# Altium schematic sheet 02_5V_Regulator_Circuit.SchDoc
size A; SheetNumber: 3; SheetTotal: 8
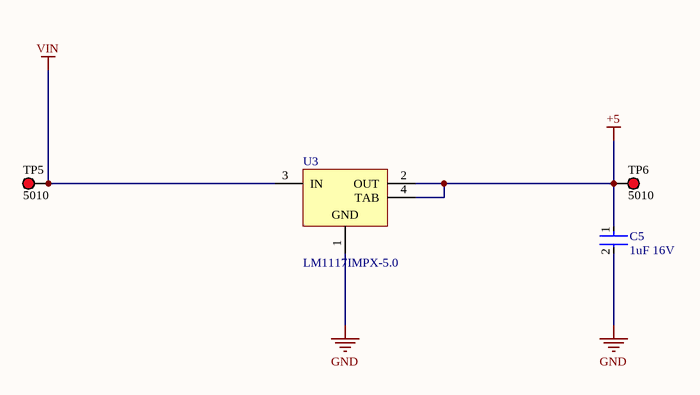
[diagram p0: 02_5V_Regulator_Circuit.SchDoc]

## Parts
C5  1uF 16V  [FP-CL10B105KO8NNNC-MFG]
TP5  5010  [KSTN-5010_V]
TP6  5010  [KSTN-5010_V]
U3  LM1117IMPX-5.0  [DCY0004A_M]

## Nets
+5: C5.1 TP6.1 U3.2(OUT) U3.4(TAB)
GND: C5.2 U3.1(GND)
VIN: TP5.1 U3.3(IN)

## Library data of the parts
C5 = CMP-2000-06093-2: CAP CER 1UF 16V X7R 0603; Manufacturer: Samsung Electro-Mechanics America, Inc; Manufacturer Part Number: CL10B105KO8NNNC; Temperature Coefficient: 15%; Material: Ceramic; Tolerance: 10%; Voltage Rating: 16V; Automotive: No; ComponentLink2Description: Datasheet; Device Class L3: Ceramic Capacitors; Capacitance: 1uF; Temperature Characteristic: X7R; Temperature Range High: +125°C; Digikey Description: CAP CER 1UF 16V X7R 0603; Device Class L2: Capacitors; Octopart: https://octopart.com/cl10b105ko8nnnc-samsung-19018973; ComponentLink2URL: http://www.samsungsem.com/global/front/downloadcms.do?path=%2F%2Fglobal%2F%2Fsupport%2F%2Fproduct-search%2F%2Fmlcc%2F%2F__icsFiles%2F%2Fafieldfile%2F%2F2019%2F%2F06%2F%2F18&fileName=CL10B105KO8NNNC-19.pdf; Lead Free: Yes; Height: 0.9mm; Package: CL10B105KO8NNNC; Temperature Range Low: -55°C; Value: 1uF; Device Class L1: Passive Components; RoHS: TRUE; Temperature: -55°C to +125°C; Category: Cap; Ipc Land Pattern Name: CAPC16080X80
TP5 TP6 = CMP-1672-00002-4: Test Point, Red, Through Hole, RoHS, Bulk; Manufacturer: Keystone; Contact Material: Bronze; Mounting Technology: Through Hole; RoHSCompliant: true; Pins: 1; Package Quantity: 100; ComponentLink2Description: Datasheet; Height: 8.12 mm; ComponentLink1URL: http://www.keyelco.com/; DatasheetVersion: Rev. F, 12/2013; Mount: Through Hole; PackageReference: 5010; Contact Plating: Silver; Packaging: Bulk; Colour: Red; REACH SVHC: No SVHC; PackageDescription: 1-Pin Through Hole Device, Dia 3.17 mm; ComponentLink2URL: http://www.keyelco.com/product-pdf.cfm?p=1319; ComponentLink1Description: Manufacturer URL
U3 = CMP-0062-01626-4: 800mA Low-Dropout Linear Regulator, 4-pin SOT-223; Manufacturer: Texas Instruments; PowerWise: N; CompType: LDO IC; High-Reliability: Y; PackageTopMarking: XYTT*N06B; ComponentLink1URL: http://www.ti.com/general/docs/lit/getliterature.tsp?genericPartNumber=LM1117-N&fileType=pdf; RoHS: N; PackageDescription: Molded SOT-223, 6.50 x 3.56 x 1.6mm Body, 4 Lead, 2.3mm Pitch; Code_JEDEC: TO-261-AA; ComponentLink1Description: Datasheet URL; PinCount: 4; PackageReference: DCY0004A; Code_IPC: SOT223-4; PartNumber: LM1117IMPX-5.0